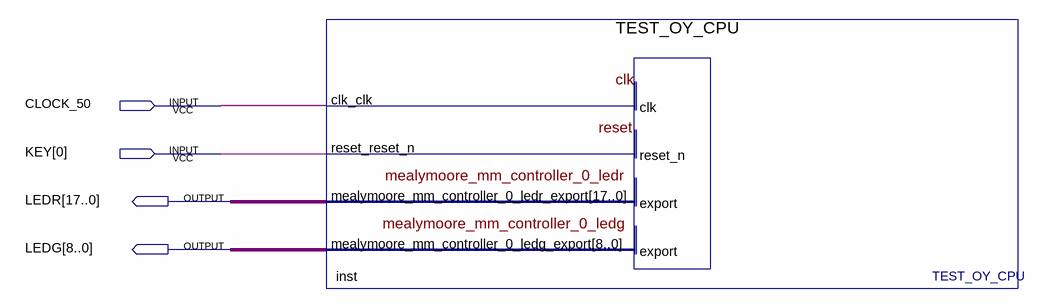
[diagram p0: schematic sheet]
// Quartus schematic TEST_OY_CPU_SYSTEM.bdf as structural Verilog: 1 symbols, 4 pins
module TEST_OY_CPU_SYSTEM (
  input  CLOCK_50,
  input  [0:0] KEY,
  output [17:0] LEDR,
  output [8:0] LEDG
);

  TEST_OY_CPU inst (
    .clk_clk(CLOCK_50), .reset_reset_n(KEY[0]), .mealymoore_mm_controller_0_ledr_export(LEDR),
    .mealymoore_mm_controller_0_ledg_export(LEDG));
endmodule
